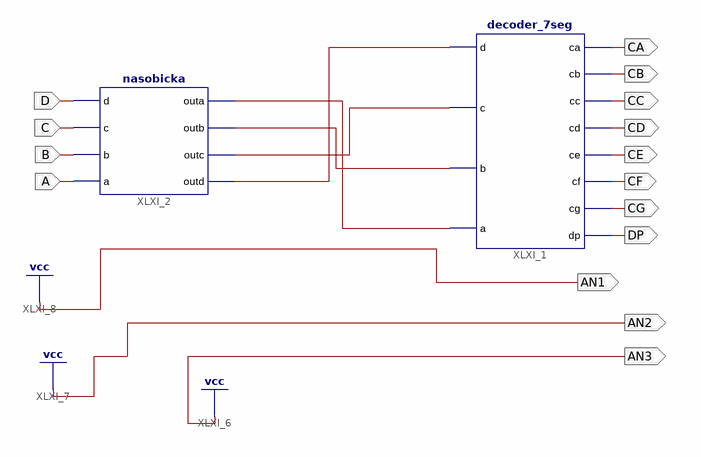
[diagram p0: schematic sheet 1]
// Xilinx ISE schematic schema_nasobicka.sch (spartan3e) as structural Verilog: 2 symbols, 15 ports
module schema_nasobicka (
  input  D,
  input  C,
  input  B,
  input  A,
  output CA,
  output CB,
  output CC,
  output CD,
  output CE,
  output CF,
  output CG,
  output DP,
  output AN1,
  output AN3,
  output AN2
);

  wire XLXN_18, XLXN_19, XLXN_20, XLXN_21;

  decoder_7seg XLXI_1 (
    .d(XLXN_21), .c(XLXN_20), .b(XLXN_19), .a(XLXN_18), .ca(CA), .cb(CB), .cc(CC), .cd(CD), .ce(CE), .cf(CF),
    .cg(CG), .dp(DP));
  nasobicka XLXI_2 (.d(D), .c(C), .b(B), .a(A), .outa(XLXN_18), .outb(XLXN_19), .outc(XLXN_20), .outd(XLXN_21));

  assign AN1 = 1'b1;
  assign AN2 = 1'b1;
  assign AN3 = 1'b1;
endmodule
